# Altium schematic sheet Connectors.SchDoc: Connectors
size Letter; DrawnBy: Qinyang Bao, Nicole Rosario; Organization: UW Robotics; Address1: 200 University Avenue; Address2: Waterloo; Address3: Ontario; Address4: Canada N2L 3G6
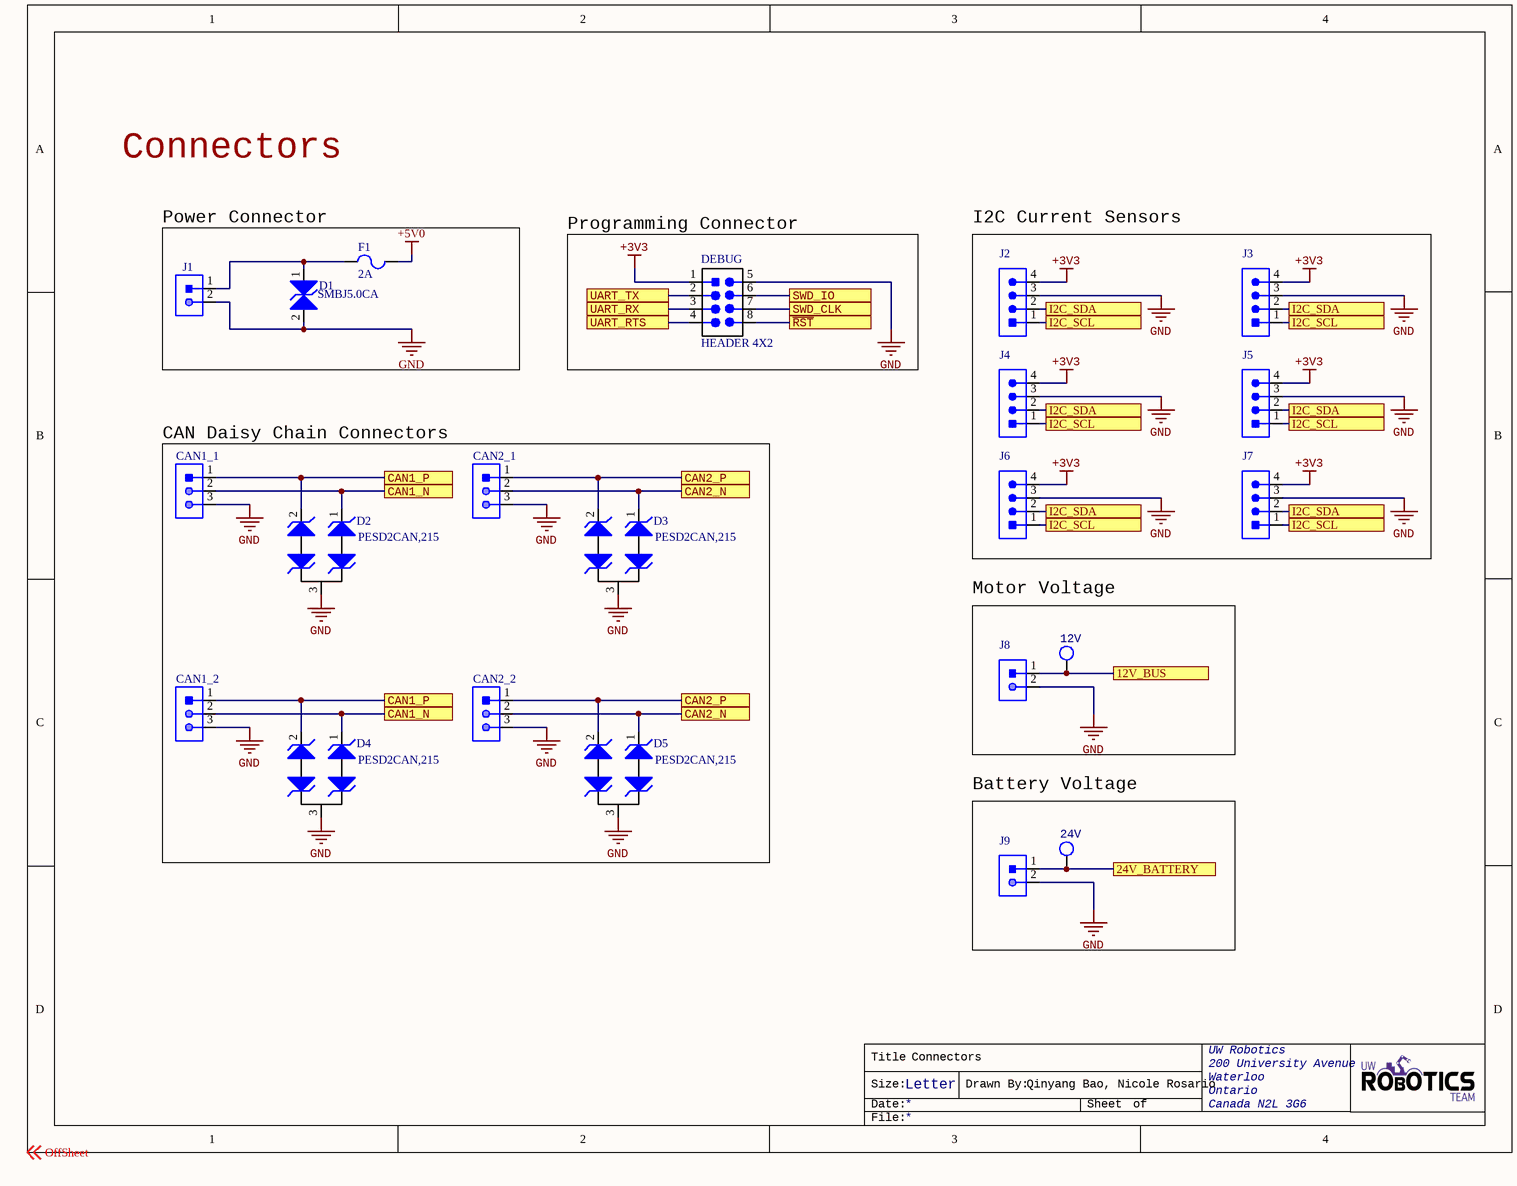
[diagram p0: Connectors.SchDoc]

## Parts
12V  TESTPOINT_LOOP  [TESTPOINT_LOOP]  (value not drawn)
24V  TESTPOINT_LOOP  [TESTPOINT_LOOP]  (value not drawn)
CAN1_1  CON_3M_SM4  [JST-B3B-SM4-TB]  (value not drawn)
CAN1_2  CON_3M_SM4  [JST-B3B-SM4-TB]  (value not drawn)
CAN2_1  CON_3M_SM4  [JST-B3B-SM4-TB]  (value not drawn)
CAN2_2  CON_3M_SM4  [JST-B3B-SM4-TB]  (value not drawn)
D1  Manufacturer Part Number 1: SMBJ5.0CA  [TVS_DIODE_BIDIRECTIONAL]  (hidden comment: TVS_DIODE_BIDIRECTIONAL)
D2  Manufacturer Part Number: PESD2CAN,215  [NXP-SOT323-3]  (hidden comment: TVS_DIODE_CAN)
D3  Manufacturer Part Number: PESD2CAN,215  [NXP-SOT323-3]  (hidden comment: TVS_DIODE_CAN)
D4  Manufacturer Part Number: PESD2CAN,215  [NXP-SOT323-3]  (hidden comment: TVS_DIODE_CAN)
D5  Manufacturer Part Number: PESD2CAN,215  [NXP-SOT323-3]  (hidden comment: TVS_DIODE_CAN)
DEBUG  HEADER 4X2  [HEADER_2X4]
F1  Current Rating: 2A  [FUSE_0603]  (hidden comment: FUSE_2A_0603)
J1  CON_2M_SM4  [JST-B2B-SM4-TB]  (value not drawn)
J2  CON_4M_SM4  [JST-B4B-SM4-TB]  (value not drawn)
J3  CON_4M_SM4  [JST-B4B-SM4-TB]  (value not drawn)
J4  CON_4M_SM4  [JST-B4B-SM4-TB]  (value not drawn)
J5  CON_4M_SM4  [JST-B4B-SM4-TB]  (value not drawn)
J6  CON_4M_SM4  [JST-B4B-SM4-TB]  (value not drawn)
J7  CON_4M_SM4  [JST-B4B-SM4-TB]  (value not drawn)
J8  CON_2M_SM4  [JST-B2B-SM4-TB]  (value not drawn)
J9  CON_2M_SM4  [JST-B2B-SM4-TB]  (value not drawn)

## Blocks framed on the sheet
Power Connector: D1 F1 J1
Programming Connector: DEBUG
I2C Current Sensors: J2-J7
CAN Daisy Chain Connectors: CAN1_1 CAN1_2 CAN2_1 CAN2_2 D2-D5
Motor Voltage: 12V J8
Battery Voltage: 24V J9

## Ports
12V_BUS, 24V_BATTERY, CAN1_N, CAN1_P, CAN2_N, CAN2_P, I2C_SCL, I2C_SDA, SWD_CLK, SWD_IO, UART_RTS, UART_RX, UART_TX, ~{RST}

## Nets
+3V3: DEBUG.1(VCC) J2.4 J3.4 J4.4 J5.4 J6.4 J7.4
+5V0: F1.2
GND: CAN1_1.3 CAN1_2.3 CAN2_1.3 CAN2_2.3 D1.2 D2.3 D3.3 D4.3 D5.3 DEBUG.5(GND) J1.2 J2.3 J3.3 J4.3 J5.3 J6.3 J7.3 J8.2 J9.2
12V_BUS: 12V.1 J8.1 ; port 12V_BUS
24V_BATTERY: 24V.1 J9.1 ; port 24V_BATTERY
~{RST}: DEBUG.8 ; port ~{RST}
CAN1_N: CAN1_1.2 CAN1_2.2 D2.1 D4.1 ; port CAN1_N
CAN1_P: CAN1_1.1 CAN1_2.1 D2.2 D4.2 ; port CAN1_P
CAN2_N: CAN2_1.2 CAN2_2.2 D3.1 D5.1 ; port CAN2_N
CAN2_P: CAN2_1.1 CAN2_2.1 D3.2 D5.2 ; port CAN2_P
I2C_SCL: J2.1 J3.1 J4.1 J5.1 J6.1 J7.1 ; port I2C_SCL
I2C_SDA: J2.2 J3.2 J4.2 J5.2 J6.2 J7.2 ; port I2C_SDA
SWD_CLK: DEBUG.7 ; port SWD_CLK
SWD_IO: DEBUG.6 ; port SWD_IO
UART_RTS: DEBUG.4 ; port UART_RTS
UART_RX: DEBUG.3 ; port UART_RX
UART_TX: DEBUG.2 ; port UART_TX
NetD1_1: D1.1 F1.1 J1.1

## Notes on the sheet
- Connectors
- Labels drawn without touching a wire or pin: OffSheet
- Title
- Size:
- Date:
- Letter
- Drawn By:
- Sheet
- of
- File:

## Library data of the parts
12V 24V = TESTPOINT_LOOP: Loop testpoint through-hole pad; Manufacturer: Keystone Electronics; Manufacturer Part Number 1: 5002; Supplier Part Number 1: 36-5002-ND; Supplier 1: Digi-Key
CAN1_1 CAN1_2 CAN2_1 CAN2_2 = CON_3M_SM4: Manufacturer: JST; Manufacturer Part Number: B3B-PH-SM4-TB(LF)(SN); Max Current Rating: 2A; Max Voltage Rating: 100V; Pitch: 2mm; Supplier 1: Digi-Key; Supplier Part Number 1: 455-1735-1-ND; ComponentLink1URL: https://datasheet.ciiva.com/11747/0900766b80ddea81-11747684.pdf?src-supplier=RSComponents; ComponentLink1Description: https://datasheet.ciiva.com/11747/0900766b80ddea81-11747684.pdf?src-supplier=RSComponents
D1 = TVS_DIODE_BIDIRECTIONAL: TVS DIODE 5V 9.2V DO214AA; Manufacturer: Nexperia USA Inc.; Manufacturer 1: Littelfuse; Max Surge Current: 65.3A; Reverse Breakdown Voltage: 6.4V; Number of Elements: 1; Peak Pulse Power: 600W; Power Line Protection: No; Max Breakdown Voltage: 7V; Test Current: 10mA; ESD Protection: Yes; Max Reverse Leakage Current: 1.6mA; Max Power Dissipation: 5W; Element Configuration: Single; MPN: SMBJ5.0CA; Package: SC-70, SOT-323; ComponentLink1Description: Datasheet; ComponentLink1URL: https://www.littelfuse.com/~/media/electronics/datasheets/tvs_diodes/littelfuse_tvs_diode_smbj_datasheet.pdf.pdf; Supplier Part Number 1: SMBJ5.0CALFCT-ND; Supplier 1: Digi-Key; Stock 1: 23233; Pricing 1: 1=0.39000, 10=0.31300, 25=0.28640, 100=0.17980, 250=0.17784, 500=0.16650, 1000=0.11322 (USD); Mount: Surface Mount; Case/Package: SMB; Number of Pins: 2; Min Operating Temperature: -65°C; Max Operating Temperature: 150°C; Direction: Bidirectional; Package Quantity: 3000; Packaging: Tape and Reel; Operating Supply Voltage: 5V; Number of Bidirectional Channels: 1; Reverse Standoff Voltage: 5V; Min Breakdown Voltage: 6.4V; Clamping Voltage: 9.2V; Breakdown Voltage: 6.4V; Number of Channels: 1; Polarity: Bidirectional; Termination: SMD/SMT; Power Dissipation: 600W; Peak Pulse Current: 65.3A; Leakage Current: 1.6mA; Voltage Rating (DC): 5V; Composition: Zener; Length: 0.179inch; Height: 0.096inch; Width: 0.155inch; Radiation Hardening: No; REACH SVHC: No SVHC; Lead Free: Lead Free
D2-D5 = TVS_DIODE_CAN: TVS DIODE 24V 41V SOT323-3; Manufacturer: Nexperia USA Inc.; Package: SC-70, SOT-323; ComponentLink1Description: Datasheet; ComponentLink1URL: https://assets.nexperia.com/documents/data-sheet/PESD1CAN-U.pdf; Supplier Part Number 1: 1727-3891-1-ND; Supplier 1: Digi-Key
DEBUG = HEADER 4X2: CONN HEADER VERT 8POS 2.54MM; Manufacturer Part Number 1: M20-9980445; Manufacturer 1: Harwin Inc.; Supplier Part Number 1: 952-2122-ND; Supplier 1: Digi-Key
F1 = FUSE_2A_0603: FUSE SMD 2A 32V; ComponentLink1URL: https://datasheet.ciiva.com/303/467-303400.pdf?src-supplier=Digi-Key; ComponentLink1Description: https://datasheet.ciiva.com/303/467-303400.pdf?src-supplier=Digi-Key; ComponentLink2URL: http://datasheet.octopart.com/0467002.NRHF-Littelfuse-datasheet-32023482.pdf?src-supplier=Future+Electronics; ComponentLink2Description: http://datasheet.octopart.com/0467002.NRHF-Littelfuse-datasheet-32023482.pdf?src-supplier=Future+Electronics; ComponentLink3URL: http://datasheet.octopart.com/0467002.NRHF-Littelfuse-datasheet-136509808.pdf?src-supplier=Future+Electronics; ComponentLink3Description: http://datasheet.octopart.com/0467002.NRHF-Littelfuse-datasheet-136509808.pdf?src-supplier=Future+Electronics; Mount: Surface Mount; Voltage Rating (AC): 32V; Voltage Rating (DC): 32V; Supplier 1: Digi-Key; Supplier Part Number 1: F7132CT-ND; Supplier Packaging 1: Cut Tape
J1 J8 J9 = CON_2M_SM4: Manufacturer: JST; Manufacturer Part Number: B2B-PH-SM4-TB(LF)(SN); Max Current Rating: 2A; Max Voltage Rating: 100V; Pitch: 2mm; Supplier 1: Digi-Key; Supplier Part Number 1: 455-1734-1-ND; ComponentLink1URL: https://datasheet.ciiva.com/11748/0900766b80ddea81-11748001.pdf?src-supplier=RSComponents; ComponentLink1Description: https://datasheet.ciiva.com/11748/0900766b80ddea81-11748001.pdf?src-supplier=RSComponents; ComponentLink2URL: https://datasheet.ciiva.com/16216/b2b-ph-sm4-tblfsn-16216102.pdf?src-supplier=Future+Electronics; ComponentLink2Description: https://datasheet.ciiva.com/16216/b2b-ph-sm4-tblfsn-16216102.pdf?src-supplier=Future+Electronics; ComponentLink3URL: https://datasheet.ciiva.com/8052/80567-8052023.pdf?src-supplier=Element14; ComponentLink3Description: https://datasheet.ciiva.com/8052/80567-8052023.pdf?src-supplier=Element14; ComponentLink4URL: https://datasheet.ciiva.com/712/eph-712504.pdf?src-supplier=Digi-Key; ComponentLink4Description: https://datasheet.ciiva.com/712/eph-712504.pdf?src-supplier=Digi-Key; ComponentLink5URL: https://datasheet.ciiva.com/712/eph-712505.pdf?src-supplier=Digi-Key; ComponentLink5Description: https://datasheet.ciiva.com/712/eph-712505.pdf?src-supplier=Digi-Key; ComponentLink6URL: https://datasheet.ciiva.com/712/eph-712506.pdf?src-supplier=Digi-Key; ComponentLink6Description: https://datasheet.ciiva.com/712/eph-712506.pdf?src-supplier=Digi-Key
J2-J7 = CON_4M_SM4: Manufacturer: JST; Manufacturer Part Number: B4B-PH-SM4-TB(LF)(SN); Max Current Rating: 2A; Max Voltage Rating: 100V; Pitch: 2mm; Supplier 1: Digi-Key; Supplier Part Number 1: 455-1736-1-ND; ComponentLink1URL: https://datasheet.ciiva.com/8052/1699381-8052048.pdf?src-supplier=Element14; ComponentLink1Description: https://datasheet.ciiva.com/8052/1699381-8052048.pdf?src-supplier=Element14; ComponentLink2URL: https://datasheet.ciiva.com/11747/0900766b80ddea81-11747504.pdf?src-supplier=RSComponents; ComponentLink2Description: https://datasheet.ciiva.com/11747/0900766b80ddea81-11747504.pdf?src-supplier=RSComponents; ComponentLink3URL: https://datasheet.ciiva.com/6747/80567-6747409.pdf?src-supplier=Newark; ComponentLink3Description: https://datasheet.ciiva.com/6747/80567-6747409.pdf?src-supplier=Newark; ComponentLink4URL: https://datasheet.ciiva.com/727/eph-727525.pdf?src-supplier=Digi-Key; ComponentLink4Description: https://datasheet.ciiva.com/727/eph-727525.pdf?src-supplier=Digi-Key; ComponentLink5URL: https://datasheet.ciiva.com/712/eph-712582.pdf?src-supplier=Digi-Key; ComponentLink5Description: https://datasheet.ciiva.com/712/eph-712582.pdf?src-supplier=Digi-Key; ComponentLink6URL: https://datasheet.ciiva.com/712/eph-712583.pdf?src-supplier=Digi-Key; ComponentLink6Description: https://datasheet.ciiva.com/712/eph-712583.pdf?src-supplier=Digi-Key